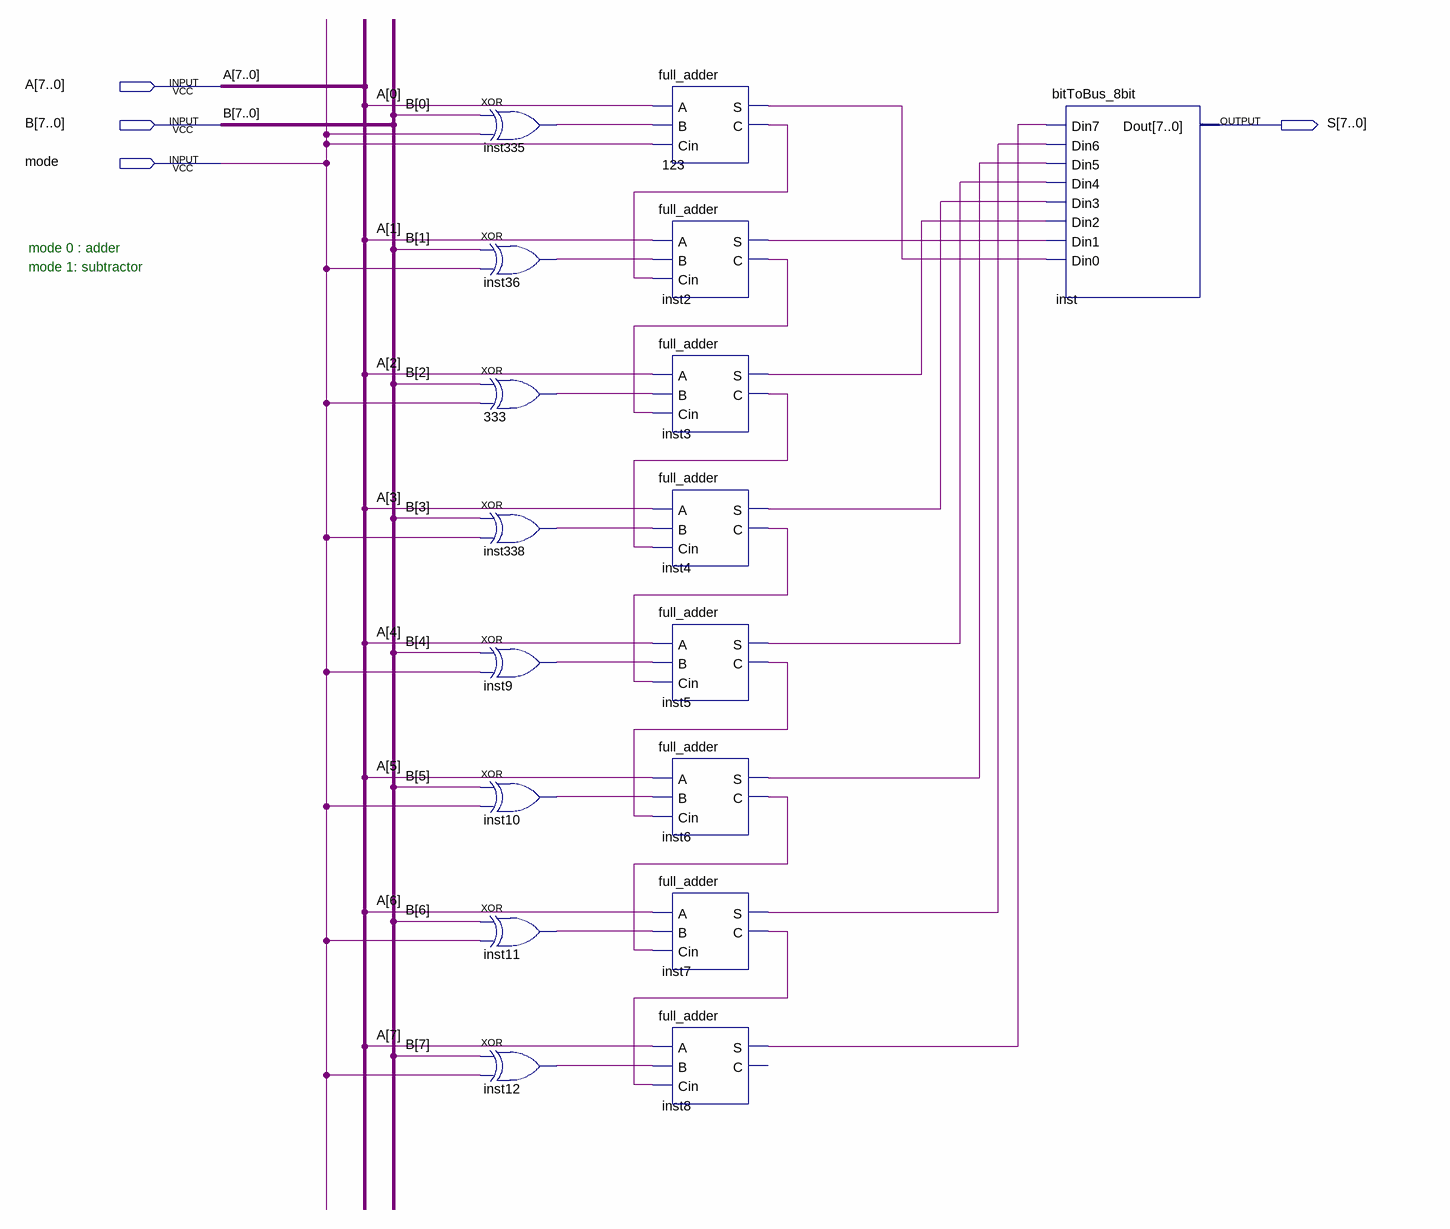
[diagram p0: schematic sheet]
// Quartus schematic adder_subtractor_8bit.bdf as structural Verilog: 17 symbols, 4 pins
module adder_subtractor_8bit (
  input  [7:0] A,
  input  [7:0] B,
  input  mode,
  output [7:0] S
);

  wire inst2_c, inst2_s, inst3_c, inst3_s, inst4_c, inst4_s, inst5_c, inst5_s, inst6_c, inst6_s, inst7_c,
       inst7_s, inst8_s, inst9_out, inst10_out, inst11_out, inst12_out, inst36_out, inst335_out, inst338_out,
       n123_c, n123_s, n333_out;

  xor inst335 (inst335_out, B[0], mode);
  xor inst36 (inst36_out, B[1], mode);
  xor u_333 (n333_out, B[2], mode);
  xor inst338 (inst338_out, B[3], mode);
  xor inst9 (inst9_out, B[4], mode);
  xor inst10 (inst10_out, B[5], mode);
  xor inst11 (inst11_out, B[6], mode);
  xor inst12 (inst12_out, B[7], mode);
  full_adder u_123 (.A(A[0]), .B(inst335_out), .Cin(mode), .S(n123_s), .C(n123_c));
  full_adder inst2 (.A(A[1]), .B(inst36_out), .Cin(n123_c), .S(inst2_s), .C(inst2_c));
  full_adder inst3 (.A(A[2]), .B(n333_out), .Cin(inst2_c), .S(inst3_s), .C(inst3_c));
  full_adder inst4 (.A(A[3]), .B(inst338_out), .Cin(inst3_c), .S(inst4_s), .C(inst4_c));
  full_adder inst5 (.A(A[4]), .B(inst9_out), .Cin(inst4_c), .S(inst5_s), .C(inst5_c));
  full_adder inst6 (.A(A[5]), .B(inst10_out), .Cin(inst5_c), .S(inst6_s), .C(inst6_c));
  full_adder inst7 (.A(A[6]), .B(inst11_out), .Cin(inst6_c), .S(inst7_s), .C(inst7_c));
  full_adder inst8 (.A(A[7]), .B(inst12_out), .Cin(inst7_c), .S(inst8_s));  // open: C
  bitToBus_8bit inst (
    .Din7(inst8_s), .Din6(inst7_s), .Din5(inst6_s), .Din4(inst5_s), .Din3(inst4_s), .Din2(inst3_s),
    .Din1(inst2_s), .Din0(n123_s), .Dout(S));

  // Notes on the sheet:
  //   mode 0 : adder
  //   mode 1: subtractor
endmodule
